# Altium project OSSI-1 LED Panel.PrjPcb
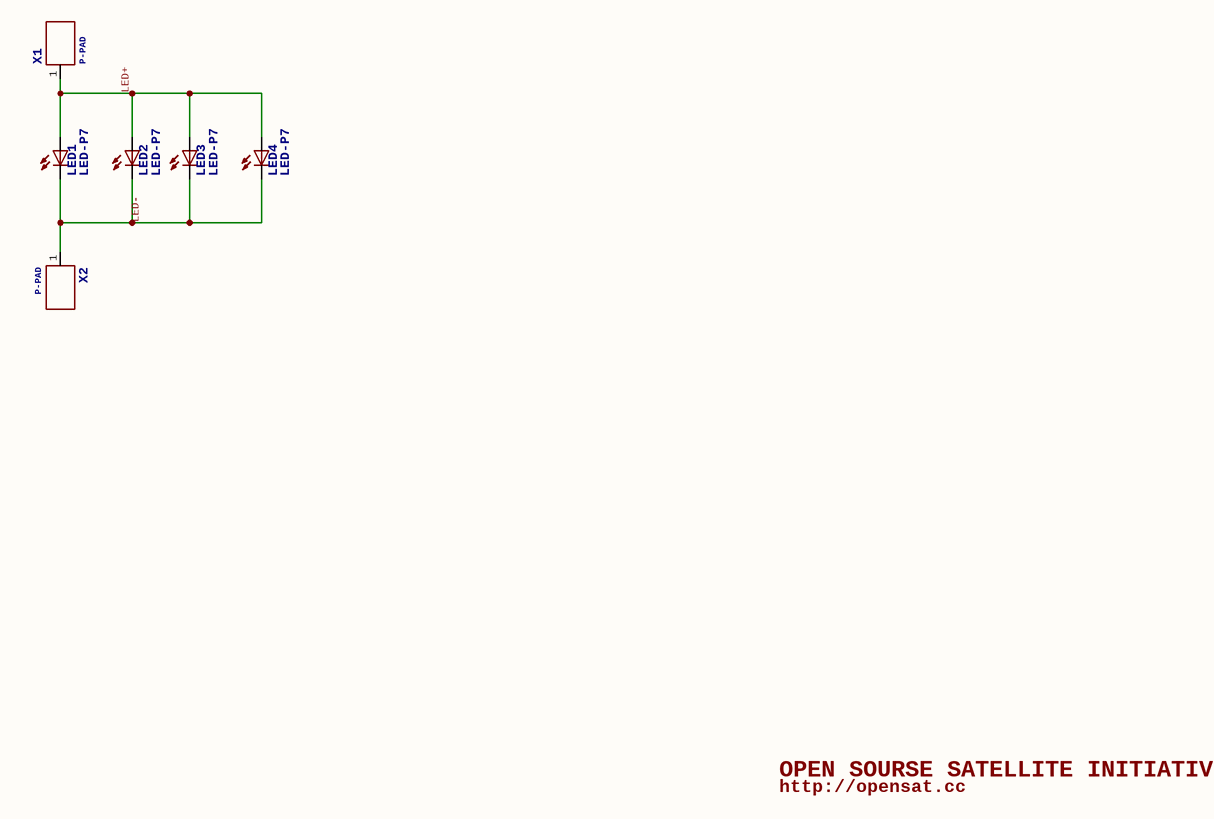
[diagram p0: OSSI-1 LED Panel.SchDoc]
1 sheet, 6 parts. Net scope: global (net labels, ports and power ports of the same name join across sheets).
Board file: OSSI-1 LED Panel.PcbDoc

## Sheet OSSI-1 LED Panel.SchDoc: TITLE:
size 410 x 286 mm; Date: Date:; >LAST_DATE_TIME: 01/11/2015 13:37:28; Sheet:: Sheet:; >SHEET: 1; REV:: REV:; Document Number:: Document Number:; >DRAWING_NAME: OSSI-1 LED Panel.sch

### Parts
LED1  >NAME: LED1  [P7]  (hidden comment: LED-P7)
LED2  >NAME: LED2  [P7]  (hidden comment: LED-P7)
LED3  >NAME: LED3  [P7]  (hidden comment: LED-P7)
LED4  >NAME: LED4  [P7]  (hidden comment: LED-P7)
X1  >NAME: X1  [P-PAD]  (hidden comment: P-PAD)
X2  >NAME: X2  [P-PAD]  (hidden comment: P-PAD)

### Nets
LED+: LED1.A LED2.A LED3.A LED4.A X1.1(P$1)
LED-: LED1.C LED2.C LED3.C LED4.C X2.1(P$1)

### Notes on the sheet
- OPEN SOURSE SATELLITE INITIATIVE
- http://opensat.cc

### Library data of the parts
LED1-LED4 = LED-P7: >VALUE: LED-P7
X1 X2 = P-PAD: >VALUE: P-PAD